# EAGLE design plaque2 (EAGLE 7.2.0)
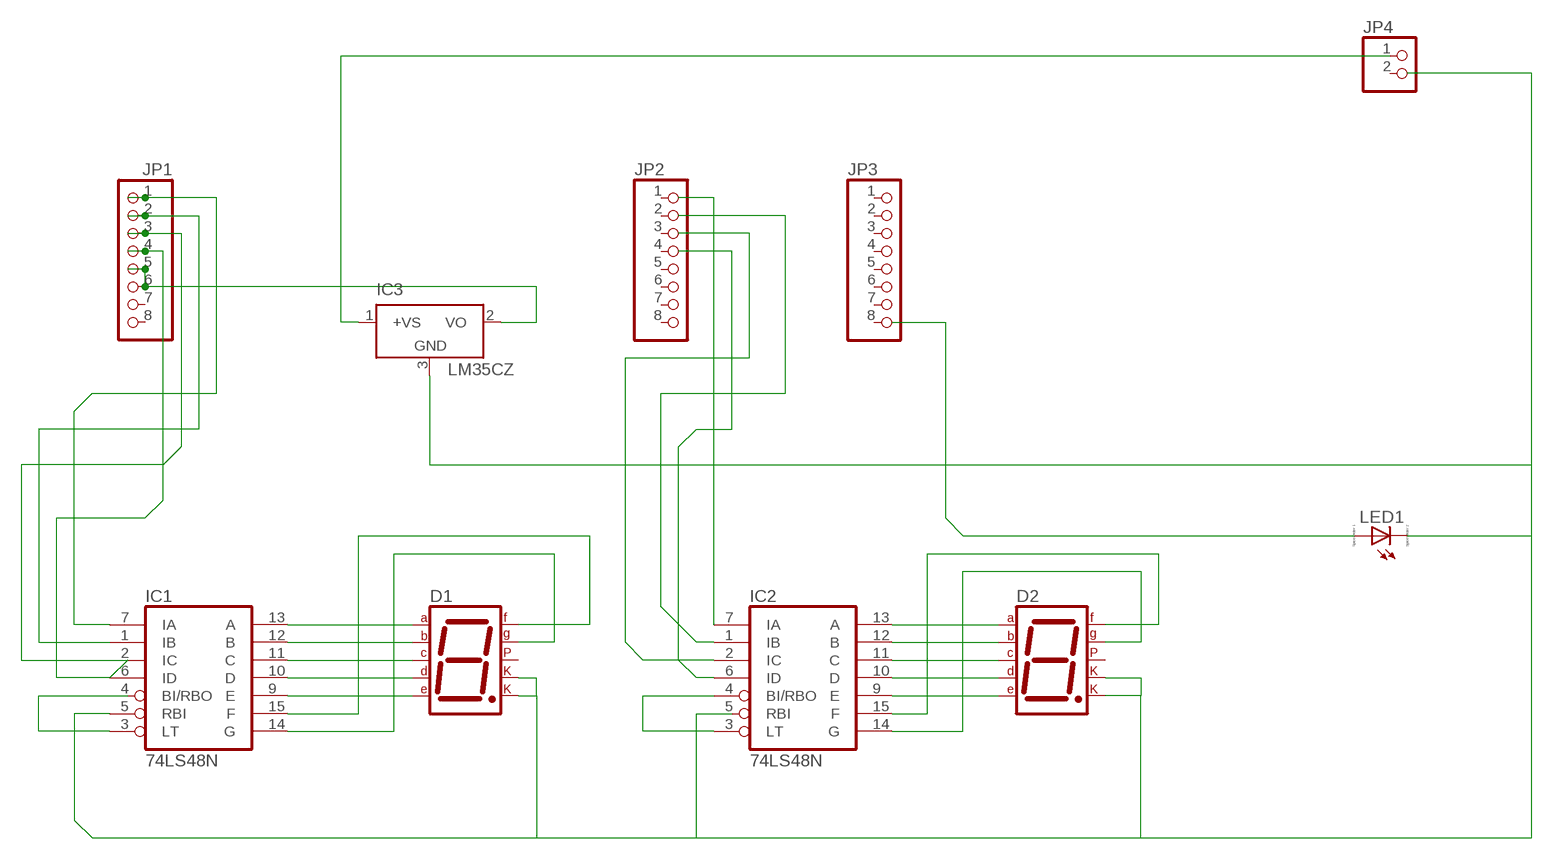
[diagram p0: schematic, sheet 1]

## Parts
D1  7SEG-CK  [7SEG-13]
D2  7SEG-CK  [7SEG-13]
IC1  74LS48N  [DIL16]
IC2  74LS48N  [DIL16]
IC3  LM35CZ  [TO92]
JP1  PINHD-1X8  [1X08]
JP2  PINHD-1X8  [1X08]
JP3  PINHD-1X8  [1X08]
JP4  PINHD-1X2  [1X02]
LED1  LED_E  [LED_1206]

## Nets
N$1: D1.7(A) IC1.13(A)
N$2: D1.6(B) IC1.12(B)
N$3: D1.4(C) IC1.11(C)
N$4: D1.2(D) IC1.10(D)
N$5: D1.1(E) IC1.9(E)
N$6: D1.9(F) IC1.15(F)
N$7: D1.10(G) IC1.14(G)
N$8: D2.7(A) IC2.13(A)
N$9: D2.6(B) IC2.12(B)
N$10: D2.4(C) IC2.11(C)
N$11: D2.2(D) IC2.10(D)
N$12: D2.1(E) IC2.9(E)
N$13: D2.9(F) IC2.15(F)
N$14: D2.10(G) IC2.14(G)
N$15: D1.3(CK1) D1.8(CK2) D2.3(CK1) D2.8(CK2) IC1.5(RBI) IC3.3(GND) LED1.C
N$16: IC1.3(LT) IC1.4(BI/RBO)
N$17: IC2.3(LT) IC2.4(BI/RBO)
N$18: IC2.7(IA)
N$19: IC2.1(IB)
N$20: IC1.7(IA) JP1.1
N$21: IC1.1(IB) JP1.2
N$22: IC1.6(ID) JP1.3 JP1.4
N$23: IC2.2(IC)
N$24: IC2.6(ID)
N$25: LED1.A
N$26: IC3.2(VO) JP1.5 JP1.6
N$27: IC3.1(+VS) JP4.1
Unconnected: D1.5(DP) D2.5(DP) IC1.2(IC) IC2.5(RBI) JP1.7 JP1.8 JP2.1 JP2.2 JP2.3 JP2.4 JP2.5 JP2.6 JP2.7 JP2.8 JP3.1 JP3.2 JP3.3 JP3.4 JP3.5 JP3.6 JP3.7 JP3.8 JP4.2

## Power pins joined to a net without a drawn wire
GND: IC1.8(GND) IC2.8(GND)
VCC: IC1.16(VCC) IC2.16(VCC)

## Library data of the parts
D1 D2 = special:7SEG-CK: 7-segment DISPLAY single cathode, 13 mm
IC1 IC2 = 74xx-eu:74*48: BCD to seven segment DECODER/DRIVER
IC3 = lm35:LM35: Single-Supply Centigrade Temperature Sensor Vout = (10mV/°C x Temp °C) +5mmmV Source: http://www.national.com/ds/LM/LM35.pdf
JP1-JP3 = pinhead:PINHD-1X8: PIN HEADER
JP4 = pinhead:PINHD-1X2: PIN HEADER
LED1 = eagle-ltspice:LED_E: LED Source: http://www.osram.convergy.de Source: www.luxeon.com Source: www.kingbright.com; SPICEMODEL: NONE; SPICEPREFIX: D; SPICETYPE: diode

## Board
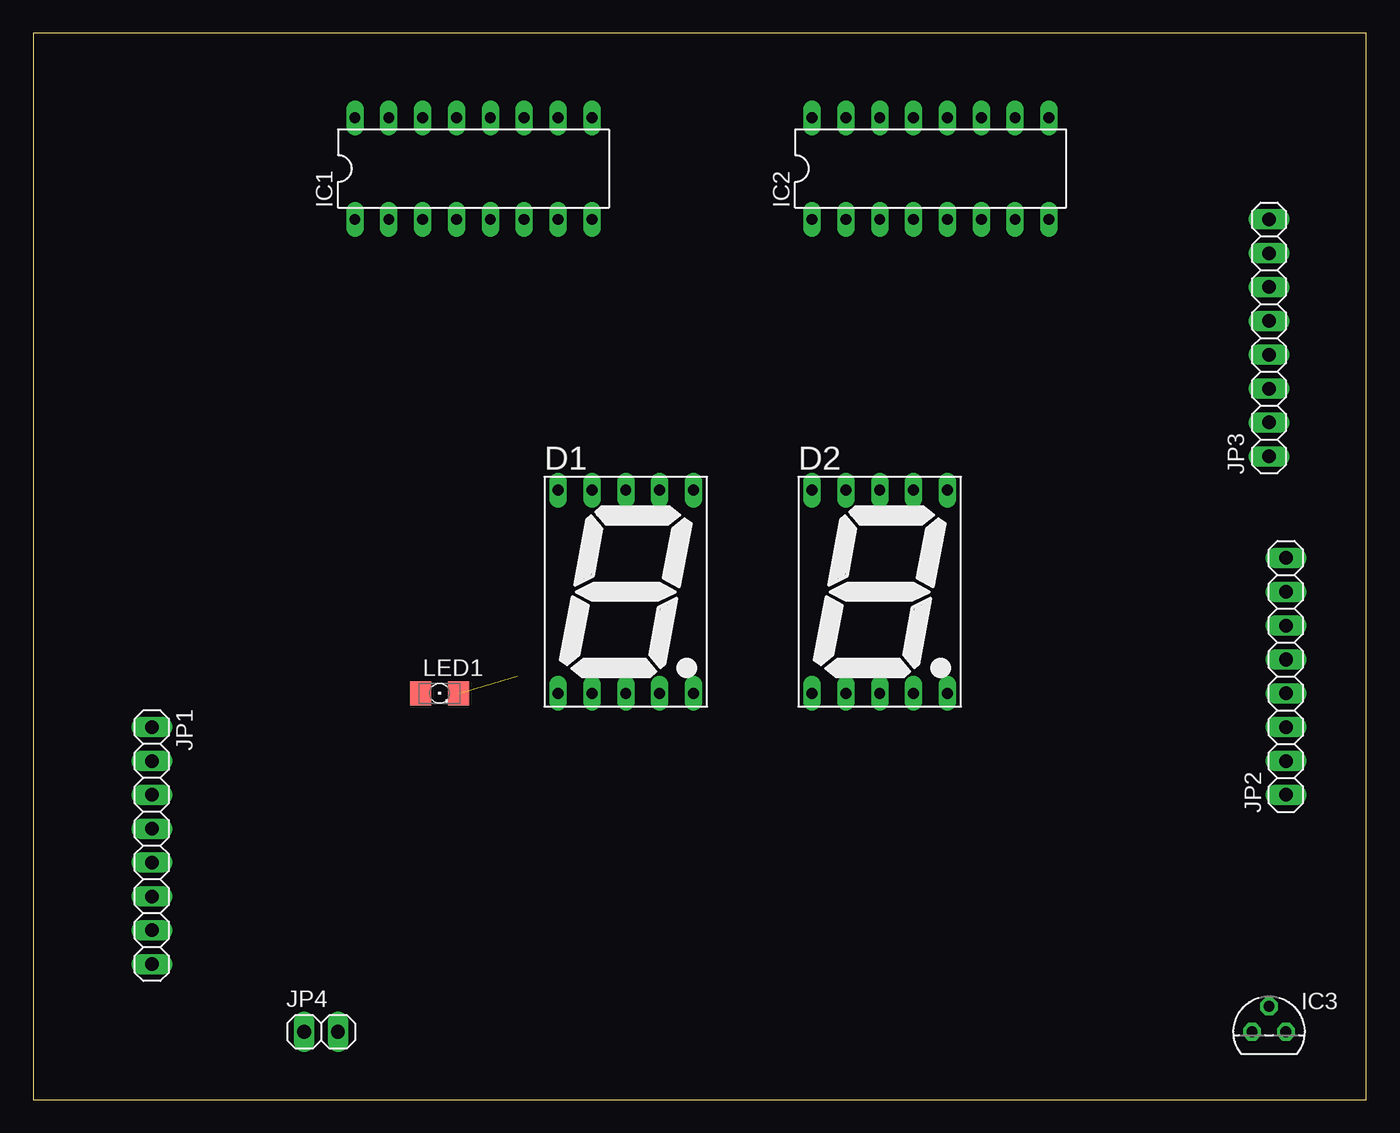
[diagram p1: board, top side]
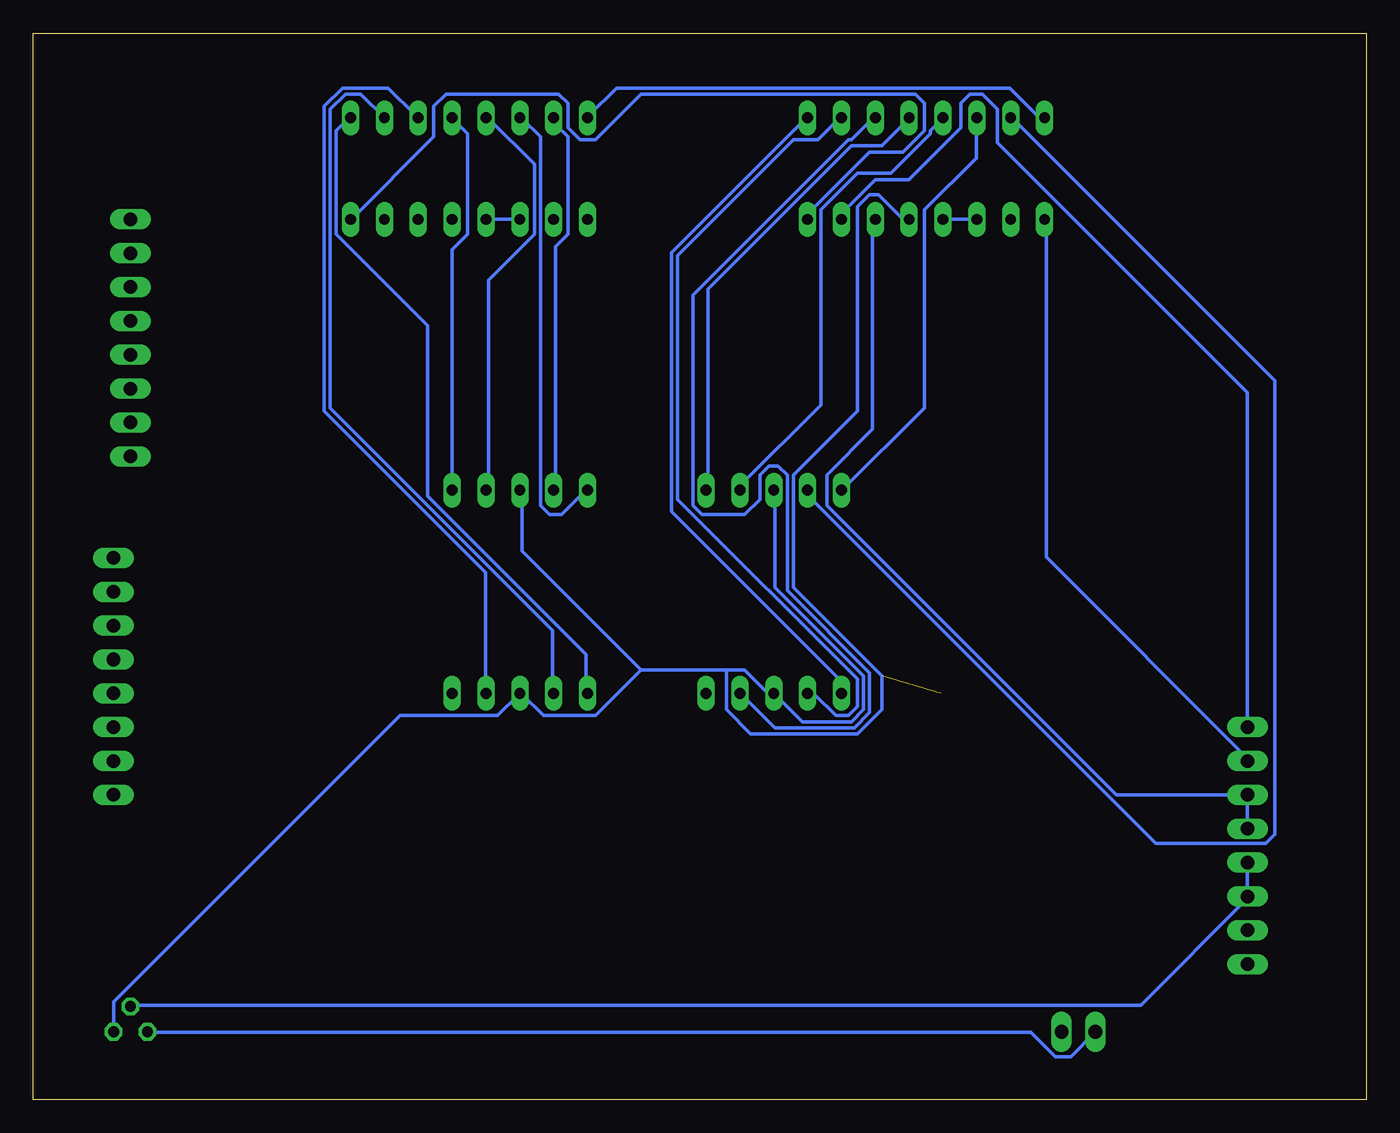
[diagram p2: board, bottom side, seen from below]

Size 100 x 80 mm. Coordinates in mm from the lower left corner, seen from the top.
Outline: 0,0 100,0 100,80 0,80 0,0
Copper layers (1*16): Top 0.035mm / dielectric 1.5mm / Bottom 0.035mm
Design rules "default": minimum track width 10mil, minimum drill 24mil, track to track 8mil, track to pad 8mil, pad to pad 8mil, via to via 8mil, smd to smd 8mil, copper to edge 40mil, drill to drill 8mil, minimum pad ring 10mil, minimum via ring 8mil, stop-mask expansion 4mil, vias tented up to drill 0mil, thermal gap 10mil

### Footprints (pad centres in the part's own frame; a part is rotated, then mirrored left to right if it is on the bottom)
7SEG-13 = drill 0.813 long: 1 -5.08,-7.62; 2 -2.54,-7.62; 3 0,-7.62; 4 2.54,-7.62; 5 5.08,-7.62; 6 5.08,7.62; 7 2.54,7.62; 8 0,7.62; 9 -2.54,7.62; 10 -5.08,7.62
DIL16 = drill 0.813 long: 1 -8.89,-3.81; 2 -6.35,-3.81; 3 -3.81,-3.81; 4 -1.27,-3.81; 5 1.27,-3.81; 6 3.81,-3.81; 7 6.35,-3.81; 8 8.89,-3.81; 9 8.89,3.81; 10 6.35,3.81; 11 3.81,3.81; 12 1.27,3.81; 13 -1.27,3.81; 14 -3.81,3.81; 15 -6.35,3.81; 16 -8.89,3.81
TO92 = drill 0.813 octagon: 1 -1.27,0; 2 0,1.905; 3 1.27,0
1X08 = drill 1.016 long: 1 -8.89,0; 2 -6.35,0; 3 -3.81,0; 4 -1.27,0; 5 1.27,0; 6 3.81,0; 7 6.35,0; 8 8.89,0
1X02 = drill 1.016 long: 1 -1.27,0; 2 1.27,0
LED_1206 = smd 1.6 x 1.803: A -1.422,0; C 1.422,0

### Placement (x,y rotation side)
D1  44.45,38.1 0 top
D2  63.5,38.1 0 top
IC1  33.02,69.85 0 top
IC2  67.31,69.85 0 top
IC3  92.71,5.08 0 top
JP1  8.89,19.05 270 top
JP2  93.98,31.75 90 top
JP3  92.71,57.15 90 top
JP4  21.59,5.08 0 top
LED1  30.48,30.48 0 top

### Tracks (layer width: path | path; a pad name or v marks a point on that pad's centre or on a via)
GND
  Bottom 0.254: IC1.8 41.83,66.06 41.83,66.52 37.26,71.09 34.75,71.09 33.15,72.69 33.15,74.75 33.83,75.44 54.41,75.44 57.84,72.01 58.98,72.01 59.89,72.92 59.89,74.75 60.58,75.44 69.04,75.44 69.95,74.52 69.95,72.24 76.12,66.06 IC2.8
N$1
  Bottom 0.254: IC1.13 31.77,73.61 32.69,72.69 32.69,72.47 35.66,69.49 38.18,69.49 40.92,66.75 40.92,52.12 46.86,46.18 46.86,45.72 D1.7
N$2
  Bottom 0.254: D1.6 49.38,45.72 49.38,60.81 38.63,71.55 36.35,71.55 34.29,73.61 IC1.12
N$3
  Bottom 0.254: IC1.11 37.03,73.61 38.63,72.01 38.86,72.01 50.52,60.35 50.52,44.58 49.84,43.89 46.63,43.89 45.49,45.03 45.49,46.86 44.81,47.55 44.12,47.55 43.43,46.86 43.43,38.18 37.26,32 37.26,29.03 38.41,27.89 44.35,27.89 46.86,30.4 D1.4
N$4
  Bottom 0.254: D1.2 41.83,30.4 41.38,30.4 39.78,28.8 38.86,28.8 38.18,29.49 38.18,31.55 51.66,45.03 51.66,63.32 42.98,72.01 41.15,72.01 39.55,73.61 IC1.10
N$5
  Bottom 0.254: D1.1 39.55,30.63 39.55,31.55 52.12,44.12 52.12,63.55 42.06,73.61 IC1.9
N$6
  Bottom 0.254: D1.9 41.83,45.72 41.83,45.26 15.77,19.2 7.54,19.2 6.86,19.89 6.86,53.95 26.52,73.61 IC1.15
N$7
  Bottom 0.254: IC1.14 29.26,73.61 29.26,70.64 33.15,66.75 33.15,51.89 39.32,45.72 D1.10
N$8
  Bottom 0.254: D2.7 65.84,45.72 65.84,61.49 62.41,64.92 62.41,70.18 65.84,73.61 IC2.13
N$9
  Bottom 0.254: D2.6 68.58,63.78 67.44,64.92 67.44,72.47 68.58,73.61 IC2.12
N$10
  Bottom 0.254: D2.4 66.06,30.63 66.06,39.55 78.18,51.66 78.18,74.52 76.81,75.89 73.38,75.89 71.32,73.84 IC2.11
N$11
  Bottom 0.254: IC2.10 75.44,75.44 76.58,75.44 77.72,74.3 77.72,51.89 61.04,35.2 61.04,30.63 D2.2
N$12
  Bottom 0.254: D2.1 58.52,30.63 58.52,33.38 70.41,45.26 70.41,58.06 77.27,64.92 77.27,72.69 76.35,73.61 IC2.9
N$13
  Bottom 0.254: D2.9 60.81,45.72 60.81,64.01 59.89,64.92 59.89,72.24 60.81,73.15 60.81,73.61 IC2.15
N$14
  Bottom 0.254: D2.10 58.52,45.72 60.35,43.89 61.27,43.89 61.95,44.58 61.95,72.24 63.32,73.61 IC2.14
N$15  (1 unrouted)
  Bottom 0.254: 54.41,32.23 48.01,32.23 | 48.01,32.23 46.63,32.23 45.03,30.63 44.58,30.63 D1.3 44.35,30.4 42.29,28.35 38.63,28.35 37.72,29.26 37.72,31.77 44.35,38.41 44.35,45.72 D1.8 | 54.41,32.23 57.84,28.8 61.72,28.8 63.32,30.4 D2.3 63.55,30.4 65.15,28.8 72.47,28.8 93.95,7.32 93.95,5.26 IC3.3 | 54.41,32.23 63.32,41.15 63.32,45.72 D2.8 | 48.01,32.23 48.01,29.26 46.18,27.43 38.18,27.43 36.35,29.26 36.35,31.77 42.98,38.41 42.98,46.86 38.18,51.66 38.18,66.98 37.26,67.89 36.58,67.89 34.75,66.06 34.29,66.06 IC1.5
N$16
  Bottom 0.254: IC1.3 29.26,66.06 31.55,66.06 IC1.4
N$17
  Bottom 0.254: IC2.3 63.55,66.06 65.84,66.06 IC2.4
N$20
  Bottom 0.254: IC1.7 39.32,66.06 39.32,66.52 36.8,69.04 34.29,69.04 30.4,72.92 30.4,74.75 29.72,75.44 28.8,75.44 27.66,74.3 27.66,71.78 8.91,53.03 8.91,28.12 JP1.1
N$21
  Bottom 0.254: IC1.1 24,65.84 24,40.69 8.91,25.6 JP1.2
N$22
  Bottom 0.254: 8.91,22.86 18.75,22.86 40.46,44.58 40.46,46.86 37.03,50.29 37.03,65.84 IC1.6 | 8.91,22.86 8.91,20.34 JP1.4 | 8.91,22.86 JP1.3
N$26
  Bottom 0.254: IC3.2 92.58,7.09 16.92,7.09 8.91,15.09 JP1.6 8.91,15.32 8.91,17.6 JP1.5
N$27
  Bottom 0.254: IC3.1 91.44,5.03 25.15,5.03 23.32,3.2 22.17,3.2 20.34,5.03 JP4.1
VCC
  Bottom 0.254: IC1.16 24.23,73.84 24.69,73.84 26.75,75.89 56.24,75.89 58.29,73.84 IC2.16